# Altium schematic sheet Sheet1.SchDoc
size 304 x 215 mm; SheetNumber: 1; SheetTotal: 1
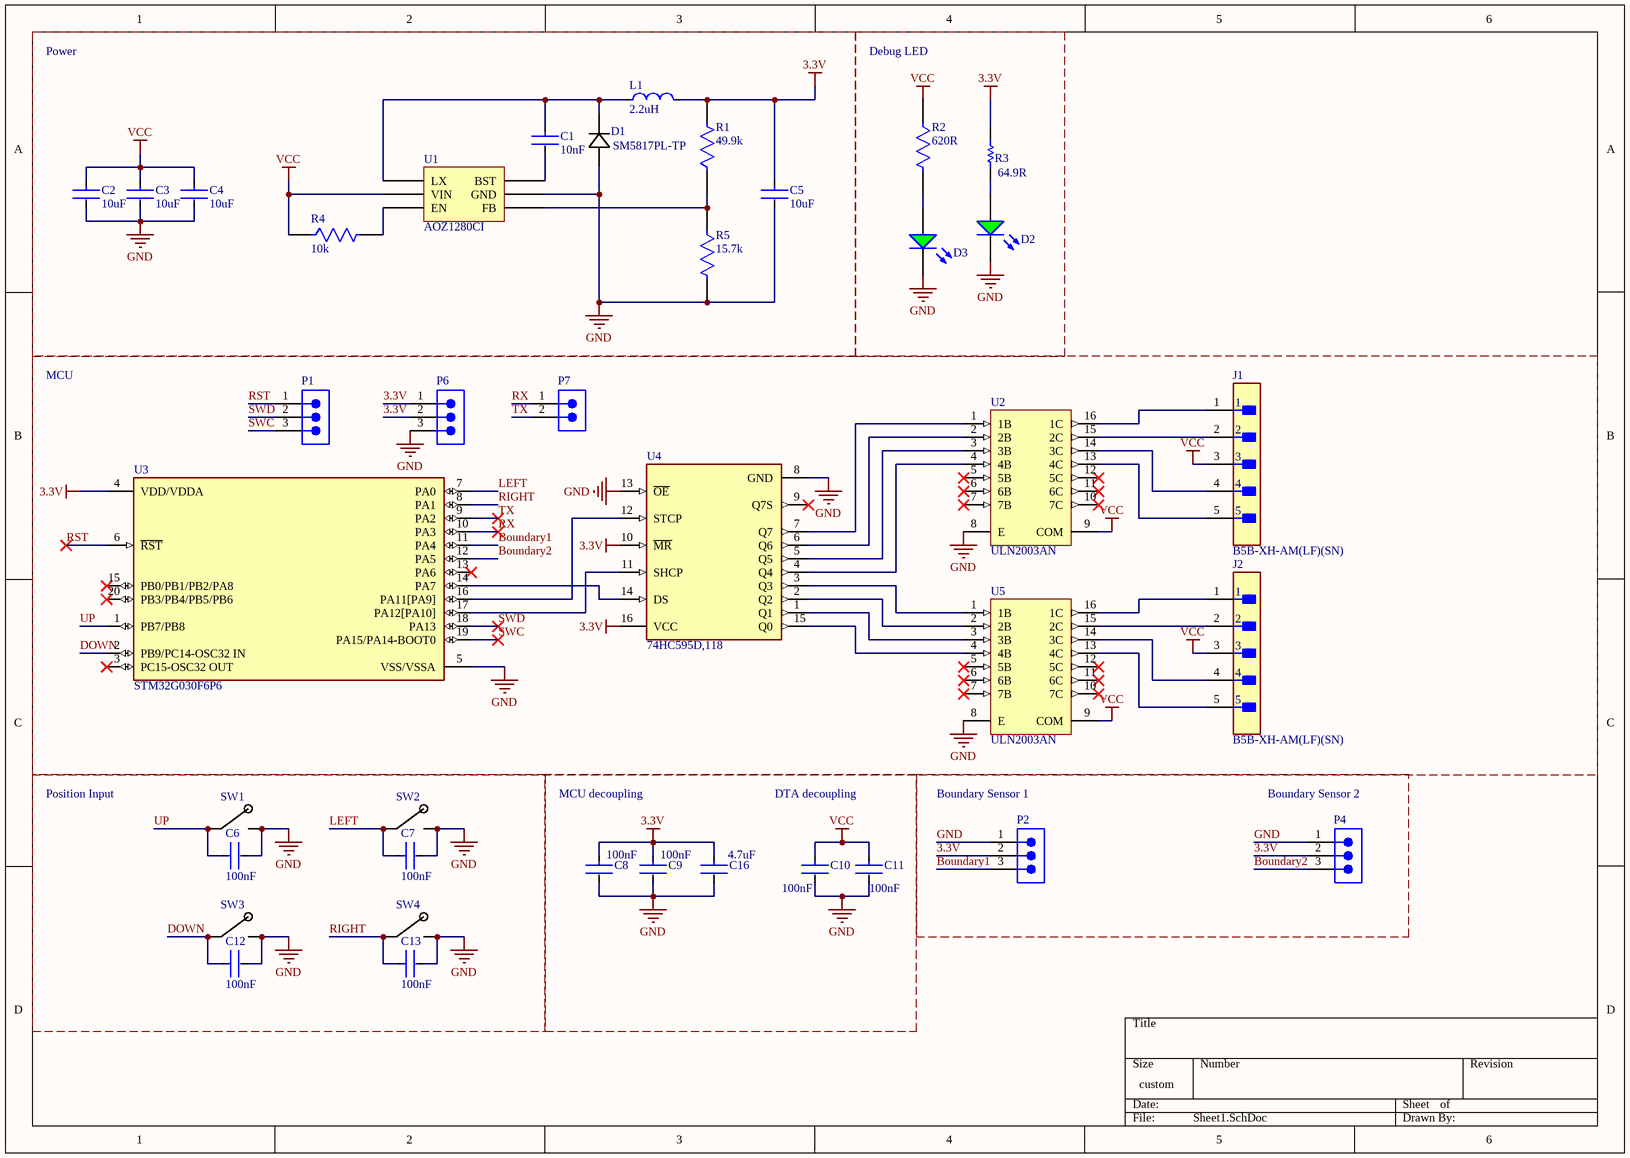
[diagram p0: Sheet1.SchDoc]

## Parts
C1  10nF  [FP-CC0603-DA-MFG]
C2  10uF  [FP-CL31-IPC_C]
C3  10uF  [FP-CL31-IPC_C]
C4  10uF  [FP-CL31-IPC_C]
C5  10uF  [FP-CL10-IPC_C]
C6  value 100nF  [FP-CL10-0_1-MFG]  (hidden comment: CL10B104JB8NNNC)
C7  value 100nF  [FP-CL10-0_1-MFG]  (hidden comment: CL10B104JB8NNNC)
C8  value 100nF  [FP-CL10-0_1-MFG]  (hidden comment: CL10B104JB8NNNC)
C9  value 100nF  [FP-CL10-0_1-MFG]  (hidden comment: CL10B104JB8NNNC)
C10  value 100nF  [FP-CL10-0_1-MFG]  (hidden comment: CL10B104JB8NNNC)
C11  value 100nF  [FP-CL10-0_1-MFG]  (hidden comment: CL10B104JB8NNNC)
C12  value 100nF  [FP-CL10-0_1-MFG]  (hidden comment: CL10B104JB8NNNC)
C13  value 100nF  [FP-CL10-0_1-MFG]  (hidden comment: CL10B104JB8NNNC)
C16  Capacitance: 4.7uF  [FP-CL10-IPC_C]  (hidden comment: CL10A475KP8NNNC)
D1  SM5817PL-TP  [SM5817PL-TP-Footprint-1]
D2  150060VS75000  [WL-SMCW_0603_150060xx75000]  (value not drawn)
D3  150060VS75000  [WL-SMCW_0603_150060xx75000]  (value not drawn)
J1  B5B-XH-AM(LF)(SN)  [FP-B5B-XH-AM_LF_SN-MFG]
J2  B5B-XH-AM(LF)(SN)  [FP-B5B-XH-AM_LF_SN-MFG]
L1  2.2uH  [FP-LQM2MPN_G0-MFG]
P1  61300311121  [61300311121]  (value not drawn)
P2  61300311121  [61300311121]  (value not drawn)
P4  61300311121  [61300311121]  (value not drawn)
P6  61300311121  [61300311121]  (value not drawn)
P7  61300211121  [61300211121]  (value not drawn)
R1  49.9k  [FP-ERJ3EK-IPC_A]
R2  Resistance: 620R  [FP-RMCF0603-MFG]  (hidden comment: RMCF0603JT620R)
R3  64.9R  [RESC1608X55X25ML10T15]
R4  10k  [FP-RMCF0603-IPC_C]
R5  15.7k  [FP-RT0603-MFG]
SW1  PTS636 SM43 SMTR LFS  [PTS636 SM43 SMTR LFS-Footprint-1]  (value not drawn)
SW2  PTS636 SM43 SMTR LFS  [PTS636 SM43 SMTR LFS-Footprint-1]  (value not drawn)
SW3  PTS636 SM43 SMTR LFS  [PTS636 SM43 SMTR LFS-Footprint-1]  (value not drawn)
SW4  PTS636 SM43 SMTR LFS  [PTS636 SM43 SMTR LFS-Footprint-1]  (value not drawn)
U1  AOZ1280CI  [SOT95P280X125-6N]
U2  ULN2003AN  [N0016A]
U3  STM32G030F6P6  [FP-TSSOP20-YA-MFG]
U4  74HC595D,118  [FP-SOT109-1-IPC_C]
U5  ULN2003AN  [N0016A]

## Blocks framed on the sheet
Power: C1-C5 D1 L1 R1 R4 R5 U1
Debug LED: D2 D3 R2 R3
MCU: J1 J2 P1 P6 P7 U2-U5
Position Input: C6 C7 C12 C13 SW1-SW4

## Nets
3.3V: C5.1 C8.1 C9.1 C16.1 L1.2 P2.2 P4.2 P6.1 P6.2 R1.2 R3.2 U3.4(VDD/VDDA) U4.10(~{MR}) U4.16(VCC)
GND: C2.2 C3.2 C4.2 C5.2 C6.2 C7.2 C8.2 C9.2 C10.2 C11.2 C12.2 C13.2 C16.2 D1.2 D2.1(K) D3.1(K) P2.1 P4.1 P6.3 R5.2 SW1.2 SW2.2 SW3.2 SW4.2 U1.2(GND) U2.8(E) U3.5(VSS/VSSA) U4.8(GND) U4.13(~{OE}) U5.8(E)
VCC: C2.1 C3.1 C4.1 C10.1 C11.1 J1.3 J2.3 R2.1 R4.1 U1.5(VIN) U2.9(COM) U5.9(COM)
Boundary1: P2.3 U3.11(PA4)
Boundary2: P4.3 U3.12(PA5)
DOWN: C12.1 SW3.1 U3.2(PB9/PC14-OSC32_IN)
LEFT: C7.1 SW2.1 U3.7(PA0)
RIGHT: C13.1 SW4.1 U3.8(PA1)
RST: P1.1 U3.6(~{RST})
RX: P7.1 U3.10(PA3)
SWC: P1.3 U3.19(PA15/PA14-BOOT0)
SWD: P1.2 U3.18(PA13)
TX: P7.2 U3.9(PA2)
UP: C6.1 SW1.1 U3.1(PB7/PB8)
NetC1_1: C1.1 D1.1 L1.1 U1.6(LX)
NetC1_2: C1.2 U1.1(BST)
NetD2_2: D2.2(A) R3.1
NetD3_2: D3.2(A) R2.2
NetJ1_1: J1.1 U2.16(1C)
NetJ1_2: J1.2 U2.15(2C)
NetJ1_4: J1.4 U2.14(3C)
NetJ1_5: J1.5 U2.13(4C)
NetJ2_1: J2.1 U5.16(1C)
NetJ2_2: J2.2 U5.15(2C)
NetJ2_4: J2.4 U5.14(3C)
NetJ2_5: J2.5 U5.13(4C)
NetR1_1: R1.1 R5.1 U1.3(FB)
NetR4_2: R4.2 U1.4(EN)
NetU2_1: U2.1(1B) U4.7(Q7)
NetU2_2: U2.2(2B) U4.6(Q6)
NetU2_3: U2.3(3B) U4.5(Q5)
NetU2_4: U2.4(4B) U4.4(Q4)
NetU3_14: U3.14(PA7) U4.14(DS)
NetU3_16: U3.16(PA11[PA9]) U4.12(STCP)
NetU3_17: U3.17(PA12[PA10]) U4.11(SHCP)
NetU4_1: U4.1(Q1) U5.3(3B)
NetU4_2: U4.2(Q2) U5.2(2B)
NetU4_3: U4.3(Q3) U5.1(1B)
NetU4_15: U4.15(Q0) U5.4(4B)

Not connected (* = marked no-connect by the designer): U2 5(5B)* 6(6B)* 7(7B)* 10(7C)* 11(6C)* 12(5C)*; U3 3(PC15-OSC32_OUT)* 13(PA6)* 15(PB0/PB1/PB2/PA8)* 20(PB3/PB4/PB5/PB6)*; U4 9(Q7S)*; U5 5(5B)* 6(6B)* 7(7B)* 10(7C)* 11(6C)* 12(5C)*

## Notes on the sheet
- MCU decoupling
- DTA decoupling
- (near P2) Boundary Sensor 1
- (near P4) Boundary Sensor 2

## Library data of the parts
C1 = CMP-2100-03600-2: CAP CER 10000PF 50V X7R 0603; Manufacturer Part Number: CC0603KRX7R9BB103; Manufacturer: YAGEO; Tolerance: 0.1; Material: Ceramic; Temperature Coefficient: 15%; Mouser Description: Multilayer Ceramic Capacitor, CC Series, 0.01 - F, - 10%, X7R, 50 V, 0603 [1608 Metric]; Digikey Description: CAP CER 10000PF 50V X7R 0603; Height: 0.9mm; Category: Cap; Temperature Characteristic: X7R; Footprint Url: http://www.yageo.com/exep/pages/download/literatures/UPY-C_GEN_24.pdf; Lead Free: Yes; Voltage Rating: 50 V; Temperature: -55°C to +125°C; Device Class L3: Ceramic Capacitors; ComponentLink2Description: Datasheet; Voltage: 50 V; Package: CC0603-DA; Octopart: https://octopart.com/cc0603krx7r9bb103-yageo-192938; Automotive: No; Temperature Range High: +125°C; Temperature Range Low: -55°C; Value: 10 nF; RoHS: TRUE; Device Class L1: Passive Components; ComponentLink2URL: http://www.yageo.com/documents/recent/UPY-GPHC_X7R_6.3V-to-50V_18.pdf; Device Class L2: Capacitors; Capacitance: 10 nF
C2-C4 = CMP-13271-000016-1: CAP CER 10UF 50V X5R 1206; Manufacturer: Samsung; Manufacturer Part Number: CL31A106KBHNNNE; Tolerance: 10%; Material: Ceramic; Temperature Coefficient: 15%; RoHS: TRUE; Ipc Land Pattern Name: CAPC320160X160; Temperature Range Low: -55°C; Value: 10uF; Device Class L3: Ceramic Capacitors; Category: Cap; Temperature Characteristic: X5R; Lead Free: Yes; Device Class L2: Capacitors; Octopart: https://octopart.com/cl31a106kbhnnne-samsung-19832778; ComponentLink2Description: Datasheet; Digikey Description: CAP CER 10UF 50V X5R 1206; Voltage: 50V; ComponentLink2URL: http://www.samsungsem.com/kr/support/product-search/mlcc/__icsFiles/afieldfile/2018/06/21/CL31A106KBHNNNE.pdf; Capacitance: 10uF; Temperature Range High: +85°C; Device Class L1: Passive Components; Height: 1.8mm; Automotive: No; Voltage Rating: 50V; Package: CL31; Temperature: -55°C to +85°C
C5 = CMP-13271-001938-1: Cap Ceramic 10uF 6.3V X5R ±20% Pad SMD 0603 +85°C T/R; Contact Plating: Tin; Height: 0.8mm; Width: 0.031inch; Min Operating Temperature: -55°C; Capacitance: 10uF; Dielectric: X5R; Voltage Rating: 6.3V; Case/Package: 0603; Package Quantity: 1; Radiation Hardening: No; Packaging: Tape and Reel; Max Operating Temperature: 85°C; Voltage: 6.3V; Thickness: 0.035inch; Mount: Surface Mount; Case Code (Imperial): 0603; Case Code (Metric): 1608; Depth: 0.8mm; Tolerance: 20%; Length: 1.6mm
C6-C13 = CMP-13271-000011-1: CAP CER 0.1UF 50V X7R 0603; Manufacturer: Samsung Electro-Mechanics America, Inc; Material: Ceramic; Temperature Coefficient: 15%; Tolerance: 5%; Ipc Land Pattern Name: CAPC16080X80; Device Class L1: Passive Components; Digikey Description: CAP CER 0.1UF 50V X7R 0603; Voltage Rating: 50V; Height: 0.9mm; ComponentLink2Description: Datasheet; Device Class L2: Capacitors; ComponentLink2URL: http://www.samsungsem.com/kr/support/product-search/mlcc/__icsFiles/afieldfile/2019/06/18/CL10B104JB8NNNC-19.pdf; Temperature Characteristic: X7R; Temperature Range High: +125°C; Lead Free: Yes; Temperature Range Low: -55°C; Category: Cap; Manufacturer Part Number: CL10B104JB8NNNC; Package: CL10-0.1; Temperature: -55°C to +125°C; Octopart: https://octopart.com/cl10b104jb8nnnc-samsung-9302151; Device Class L3: Ceramic Capacitors; RoHS: TRUE; Automotive: No; Capacitance: 100nF
C16 = CMP-13271-003017-1: Cap Ceramic 4.7uF 10V X5R ±10% Pad SMD 0603 +85°C T/R; Case/Package: 0603; Packaging: Tape and Reel; Width: 0.031inch; Contact Plating: Tin; Thickness: 0.035inch; Package Quantity: 1; Voltage Rating: 10V; Case Code (Metric): 1608; Case Code (Imperial): 0603; Depth: 0.8mm; Height: 0.8mm; Tolerance: 10%; Max Operating Temperature: 85°C; Length: 1.6mm; Dielectric: X5R; Mount: Surface Mount; Radiation Hardening: No; Min Operating Temperature: -55°C
D1 = CMP-020-000001-3: DIODE SCHOTTKY 20V 1A SOD123FL
D2 D3 = CMP-1426-00006-6: NexarPartId: 29717778; Reverse Voltage: 5V; Forward Voltage: 2V; Viewing Angle: 140°; Luminous Intensity: 40mcd; Test Current: 20mA; Max Junction Temperature (Tj): 95°C; Wavelength: 570nm; Forward Current: 100mA; Color: Green; Lens Style: Clear, Rectangular; Power Dissipation: 72mW; Peak Wavelength: 572nm; Packaging: Tape and Reel; REACH SVHC: Unknown; Width: 800µm; Max Operating Temperature: 85°C; Number of Pins: 2; RoHS: Compliant; Dominant Wavelength: 570nm; Min Operating Temperature: -40°C; Case Code (Imperial): 0603; Height: 700µm; Length: 1.6mm; Case Code (Metric): 1608; Case/Package: 0603; Max Reverse Voltage (DC): 5V; Mount: Surface Mount
J1 J2 = CMP-17439-000304-1: CONN HEADER VERT 5POS 2.5MM; Mated Stacking Heights: 9.8mm; Voltage Rating: 250V; Max Current Rating: 3A; Number of Positions: 5; Contact Resistance: 20mR; Depth: 5.75mm; Connector Type: Header; Color: Green; Insulation Material: Nylon; Contact Plating: Copper; Length: 14.9mm; Fastening Type: Detent; Contact Material: Brass; Number of Rows: 1; Contact Type: Male Pin; Housing Material: Polyamide; Housing Color: White; Lead Free: Lead Free; Max Voltage Rating (AC): 250V; Mount: Through Hole; Contact Shape: Square; Min Operating Temperature: -25°C; Packaging: Bulk; Orientation: Straight; Insulation Color: Natural; Series: XH; Flammability Rating: UL94 V-0; Contact Finish - Mating: TIN; Max Operating Temperature: 85°C; Termination: Solder; Pitch: 2.5mm
L1 = CMP-06042-016770-1: Multilayer Type Inductor for Power Lines, 0806 (2016), 2.2μH, 30%, 0.138Ω, 1.2A; Shielding: Shielded; Test Frequency: 1MHz; DC Resistance (DCR): 138mR; Core Material: Ferrite; Self Resonant Frequency: 40MHz; Packaging: Tape and Reel; Mount: Surface Mount; Package Quantity: 1; Case Code (Imperial): 0806; Width: 0.063inch; DC Current: 1.2A; Min Operating Temperature: -55°C; Radiation Hardening: No; Tolerance: 30%; RoHS Compliant: Yes; Case/Package: 0806; Lead Free: Lead Free; Height - Seated (Max): 0.039inch; Max Operating Temperature: 125°C; Series: LQM2MPN_G0; Height: 1mm; Inductance Tolerance: 30%; Length: 0.079inch; Case Code (Metric): 2016; Inductance: 2.2uH; Military Standard: Not; Depth: 1.75mm; Termination: SMD/SMT; Max DC Current: 1.2A; REACH SVHC: No SVHC; Current Rating: 1.2A
P1 P2 P4 P6 = CMP-1502-01062-3: NexarPartId: 32855521; Current Rating: 3A; Voltage Rating: 250V; Number of Positions: 3; Pitch: 2.54mm; Contact Resistance: 20mΩ; Connector Type: Male Pin; Gender: Male; REACH SVHC: Unknown; Packaging: Bulk; Contact Material: Copper; Min Operating Temperature: -40°C; Number of Rows: 1; Orientation: Vertical; RoHS: Compliant; Contact Plating: Gold; Max Operating Temperature: 105°C; Mount: Through Hole; Height: 8.94mm; Operating Supply Voltage: 250V; Number of Pins: 3; Contact Mating Length: 5.9944mm; Number of Contacts: 3; Color: Black; Lead Free: Lead Free; Lead Pitch: 2.54mm; Termination: Solder
P7 = CMP-1712-00002-6: NexarPartId: 20081794; Number of Contacts: 2; Pitch: 2.54mm; Connector Type: Male Pin; Voltage Rating: 250V; Current Rating: 3A; Gender: Male; Contact Resistance: 20mΩ; Height: 8.94mm; Lead Free: Lead Free; Number of Pins: 2; Termination: Through Hole; RoHS: Compliant; Lead Pitch: 2.54mm; REACH SVHC: No SVHC; Housing Material: PBT; Contact Mating Length: 5.9944mm; Min Operating Temperature: -40°C; Orientation: Vertical; Contact Material: Copper; Contact Gender: Male; Max Operating Temperature: 125°C; Number of Rows: 1; Number of Positions: 2; Packaging: Bulk; Contact Plating: Gold; Mount: Through Hole; Color: Black; Operating Supply Voltage: 250V
R1 = CMP-2000-00536-2: RES SMD 49.9K OHM 1% 1/10W 0603; Power Rating: 100mW; Resistance: 49.9kR; Voltage Rating: 75V; Temperature Coefficient: 100ppm/°C; Voltage Rating (DC): 50V; Construction: Rectangular; Width: 0.8mm; Series: ERJ; Mount: Surface Mount; Radiation Hardening: No; Packaging: Tape and Reel; Number of Terminations: 2; Case/Package: 0603; Size Code: 0603; Technology: THICK FILM; Max Operating Temperature: 155°C; Tolerance: 1%; Termination: SMD/SMT; Lead Free: Lead Free; Case Code (Imperial): 0603; Resistance Tolerance: 1%; REACH SVHC: No SVHC; Features: Automotive AEC-Q200; Package Quantity: 1; RoHS Compliant: Yes; Min Operating Temperature: -55°C; Contact Plating: Tin; Weight: 7.1E-05oz; Case Code (Metric): 1608; Depth: 0.8mm; Resistor Type: Thick Film; Military Standard: Not; Height: 0.45mm; Max Power Dissipation: 100mW; Length: 1.6mm
R2 = CMP-26527-007271-1: 620Ω ±5% 0.1W 0603 Thick Film Chip Resistor AEC-Q200 compliant; Max Power Dissipation: 100mW; Temperature Coefficient: 200ppm/°C; Mount: Surface Mount; Number of Terminations: 2; Height: 0.022inch; Lead Free: Lead Free; Contact Plating: Tin; Length: 0.061inch; Resistor Type: Thick Film; RoHS Compliant: Yes; Power Rating: 100mW; Radiation Hardening: No; Case Code (Metric): 1608; Case Code (Imperial): 0603; Max Operating Temperature: 155°C; Width: 0.031inch; Case/Package: 0603; Tolerance: 5%; Series: RMCF; Min Operating Temperature: -55°C; Features: Automotive AEC-Q200; Size Code: 0603; Packaging: Tape and Reel
R3 = CMP-2000-04108-1: RES 64.9 OHM 1% 1/10W 0603; Manufacturer: Yageo; Part Number: RC0603FR-0764R9L
R4 = CMP-26527-002098-1: 10kΩ ±5% 0.1W 0603 Thick Film Chip Resistor AEC-Q200 compliant; Power Rating: 100mW; Temperature Coefficient: 100ppm/°C; Resistance: 10kR; Radiation Hardening: No; Military Standard: Not; Mount: Surface Mount; Resistor Type: Thick Film; Size Code: 0603; Case/Package: 0603; Min Operating Temperature: -55°C; Construction: Rectangular; Series: RMCF; Width: 0.031inch; Length: 1.55mm; Case Code (Metric): 1608; Depth: 0.8mm; Height: 0.022inch; Packaging: Tape and Reel; Lead Free: Lead Free; Tolerance: 5%; Case Code (Imperial): 0603; Max Operating Temperature: 155°C; Contact Plating: Tin; Max Power Dissipation: 100mW; Features: Automotive AEC-Q200; Number of Terminations: 2
R5 = CMP-03412-026559-1: RES SMD 15.8K OHM 0.1% 1/10W; Manufacturer Part Number: RT0603BRD0715K8L; Manufacturer: Yageo; Value: 15.8KΩ; Temperature Coefficient: 25 ppm/°C; Tolerance: 0.001; Voltage Rating: 75V; Power Rating: 0.1W; Mouser Description: Thin Film Resistors 1/10W 15.8K ohm .1% 25ppm; Resistance: 15.8KΩ; Digikey Description: RES SMD 15.8K OHM 0.1% 1/10W; Package: RT0603; Lead Free: Yes; Device Class L1: Passive Components; Footprint Url: http://www.yageo.com/exep/pages/download/literatures/PYu-R_Mount_10.pdf; Octopart: https://octopart.com/rt0603brd0715k8l-yageo-1418310; Temperature Range High: +155°C; Height: 0.55mm; Composition: Thin Film; RoHS: TRUE; Device Class L3: Chip SMD Resistors; Device Class L2: Resistors; Ipc Land Pattern Name: RESC16080X45; Temperature: -55°C to +155°C; Temperature Range Low: -55°C; Category: Res; Automotive: No; ComponentLink2Description: Datasheet; ComponentLink2URL: http://www.yageo.com/documents/recent/PYu-RT_1-to-0.01_RoHS_L_9.pdf; Series: RT
SW1-SW4 = CMP-014-000005-2: SWITCH TACTILE SPST-NO 0.05A 12V
U1 = CMP-002-000004-2: Buck Switching Regulator IC Positive Adjustable 0.8V 1 Output 1.2A SOT-23-6
U2 U5 = CMP-2000-07352-1: High-Voltage, High-Current Darlington Transistor Array, 50 V, 500 mA, -20 to 70 degC, 16-Pin PDIP (N), Pb-Free (RoHS), Tube; Manufacturer: TexasInstruments; Maximum Collector Emitter Saturation Voltage: 1.1@100mA; Peak DC Collector Current: 0.5A; Package Version: 4040049/E, 12/2002; Configuration: Array7; Maximum Collector Emitter Voltage: 50V; Rad Hard: No; Mounting: ThroughHole; Datasheet URL: http://www.ti.com/general/docs/lit/getliterature.tsp?genericPartNumber=uln2003a&fileType=pdf; Package: 16PDIP; Package Reference: N16; Datasheet Version: Rev. O, 01/2016; Mounting Technology: ThroughHole; Package Description: 16-Pin Plastic In-Line, Body 19.305 x 6.35 mm, Pitch 2.54 mm; Manufacturer URL: http://www.ti.com/; Type: NPN; Category: DarlingtonBJT; Package URL: http://www.ti.com/litv/pdf/mpdi002c; Packaging: Rail/Tube
U3 = CMP-12105-000034-1: ARM MICROCONTROLLERS - MCU; Manufacturer: STMicroelectronics; Max Supply Voltage: 3.6V; Interface: I2C,SPI,USART,LIN,IrDA,I2S,SMBus; Memory Size: 32KBytes; Number Of I/Os: 17; Number Of Timers/Counters: 6; Core Architecture: ARM Cortex-M0+; Number Of Pwm Channels: 11; Standoff Height: 0.05mm; Number Of A/D Converters: 1; Number Of I2C Channels: 2; Data Bus Width: 32bits; Ram Size: 8KBytes; Max Junction Temp: +105°C; Number Of Spi Channels: 3; Min Supply Voltage: 2V; Number Of Adc Channels: 16; Memory Type: FLASH; Frequency: 64MHz; Ambient Temperature Range Low: -40°C; ComponentLink2URL: https://www.st.com/resource/en/datasheet/stm32g030f6.pdf; Temperature Range Low: -40°C; Automotive: No; Device Class L1: Integrated Circuits (ICs); Category: IC; Temperature Range High: +85°C; ComponentLink2Description: Datasheet; Device Class L2: Embedded Processors and Controllers; Manufacturer Part Number: STM32G030F6P6; Height: 1.2mm; Ambient Temperature Range High: +85°C; Octopart: https://octopart.com/stm32g030f6p6-stmicroelectronics-103773023; Package: TSSOP20-YA; Temperature: -40°C to +85°C; Lead Free: Yes; Device Class L3: Microcontrollers; Number Of Uart Channels: 2; RoHS: TRUE; Number Of Cores: 1; Digikey Description: ARM MICROCONTROLLERS - MCU
U4 = CMP-14351-000006-1: IC SHIFT REGISTER 8BIT 16SOIC; RoHS Compliant: Yes